# Altium schematic sheet GTM_BallGrippersMotorConnector.SchDoc
size A4
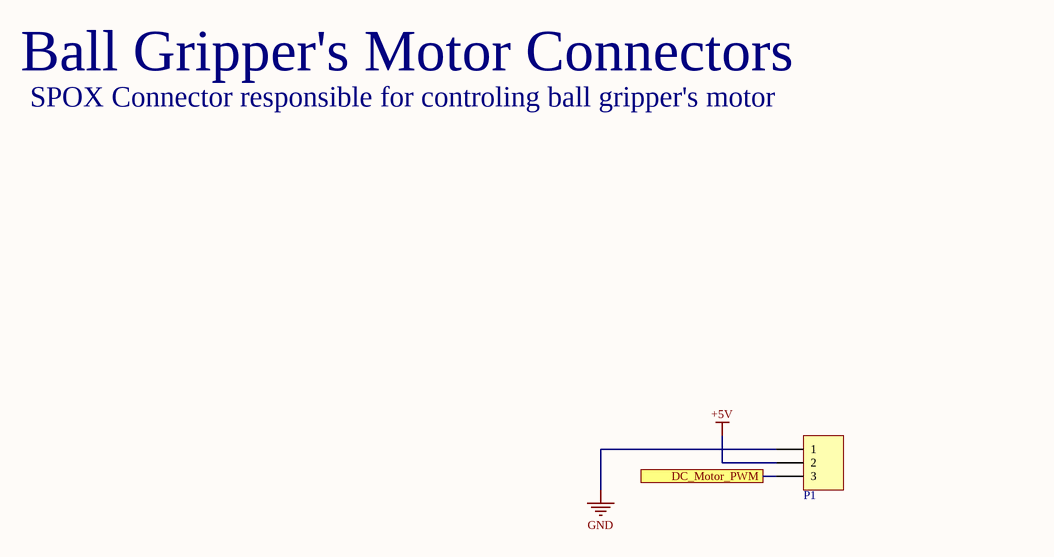
[diagram p0: GTM_BallGrippersMotorConnector.SchDoc]

## Parts
P1  HDR1X3  [Molex SPOX Horizontal 3 Circuits]  (value not drawn)

## Ports
DC_Motor_PWM

## Nets
+5V: P1.2
GND: P1.1
DC_Motor_PWM: P1.3 ; port DC_Motor_PWM

## Notes on the sheet
- Ball Gripper's Motor Connectors
- SPOX Connector responsible for controling ball gripper's motor
- Project
- Rev.
- Title
- Drawn by
- Date
- Sheet
- of
- Checked by

## Library data of the parts
P1 = HDR1X3: Header, 3-Pin; LatestRevisionDate: 17-Jul-2002; LatestRevisionNote: Re-released for DXP Platform.; Publisher: Altium Limited